# EAGLE schematic m328 (EAGLE 6.5.0)
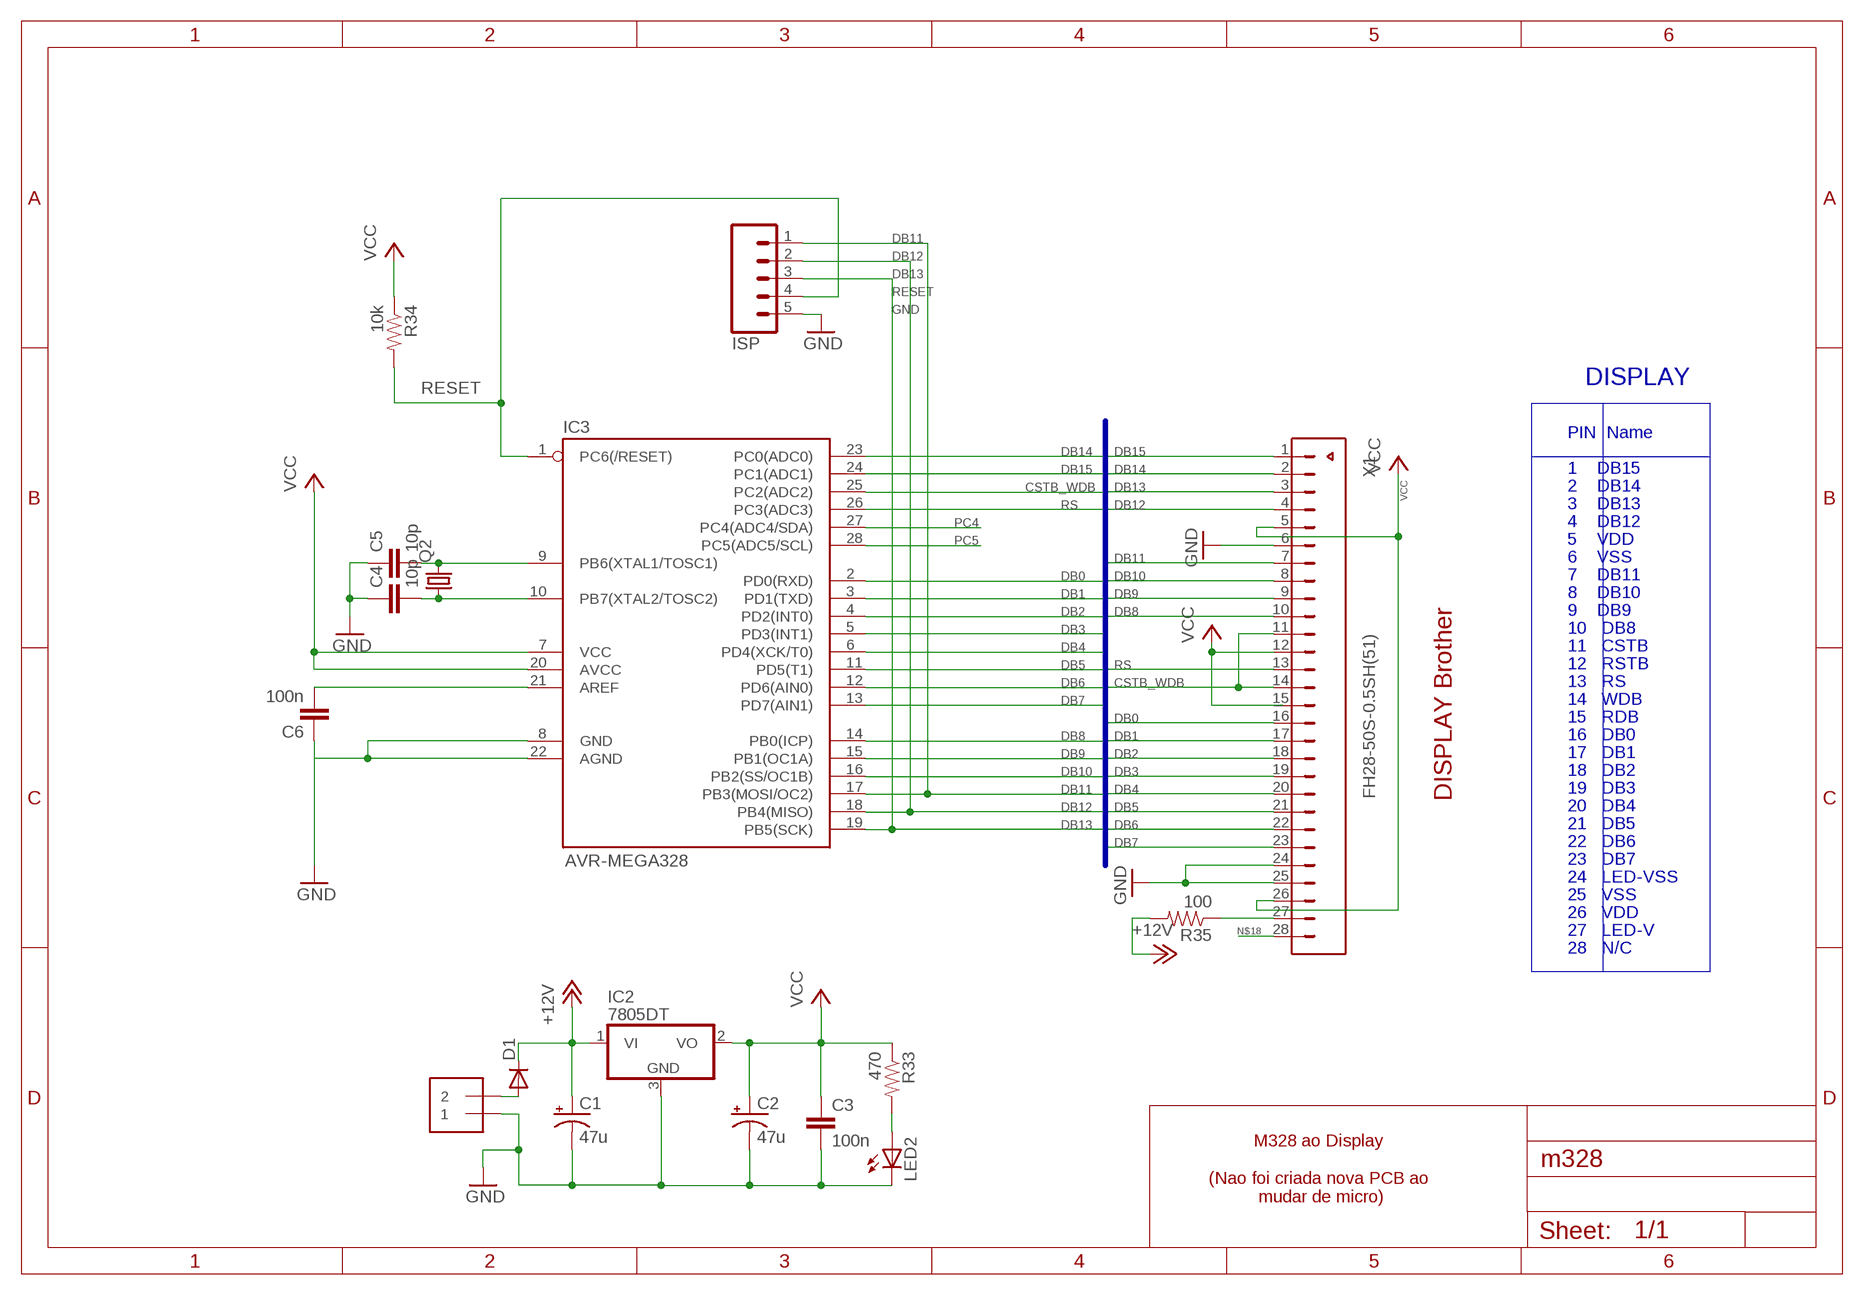
[diagram p0: schematic, sheet 1]

## Parts
C1  47u  CAP_POL1206-KIT  [EIA3216-KIT]
C2  47u  CAP_POL1206-KIT  [EIA3216-KIT]
C3  100n  CAP0805  [0805]
C4  10p  CAP0805  [0805]
C5  10p  CAP0805  [0805]
C6  100n  CAP0805  [0805]
D1  DIODESMA-KIT  [SMA-DIODE-KIT]
IC2  7805DT  [TO252]
IC3  AVR-MEGA328  AVR-MEGA8-PPTH  [DIL28-3]
ISP  M05PTH_LONGPADS  [1X05_LONGPADS]
J2  1X2-3.5MM  [1X2-3.5MM]
LED2  LED3MM  [LED3MM]
Q2  CRYSTALHC49UP  [HC49UP]
R33  470  RESISTOR0805-RES  [0805]
R34  10k  RESISTOR0805-RES  [0805]
R35  100  RESISTOR0805-RES  [0805]
X1  FH28-50S-0.5SH(51)  [FH28-50S-0.5SH(51)]

## Nets
+12V [+12V]: C1.A(+) D1.C IC2.1(VI) R35.2
CSTB_WDB: IC3.25(PC2(ADC2)) X1.11 X1.14
DB0: IC3.2(PD0(RXD)) X1.16
DB1: IC3.3(PD1(TXD)) X1.17
DB2: IC3.4(PD2(INT0)) X1.18
DB3: IC3.5(PD3(INT1)) X1.19
DB4: IC3.6(PD4(XCK/T0)) X1.20
DB5: IC3.11(PD5(T1)) X1.21
DB6: IC3.12(PD6(AIN0)) X1.22
DB7: IC3.13(PD7(AIN1)) X1.23
DB8: IC3.14(PB0(ICP)) X1.10
DB9: IC3.15(PB1(OC1A)) X1.9
DB10: IC3.16(PB2(SS/OC1B)) X1.8
DB11: IC3.17(PB3(MOSI/OC2)) ISP.1 X1.7
DB12: IC3.18(PB4(MISO)) ISP.2 X1.4
DB13: IC3.19(PB5(SCK)) ISP.3 X1.3
DB14: IC3.23(PC0(ADC0)) X1.2
DB15: IC3.24(PC1(ADC1)) X1.1
GND [GND]: C1.C(-) C2.C(-) C3.2 C4.1 C5.1 C6.1 IC2.3(GND) IC3.8(GND) IC3.22(AGND) ISP.5 J2.1 LED2.K(C) X1.6 X1.24 X1.25
N$1: LED2.A R33.2
N$18: X1.28
N$53 [+12V]: D1.A J2.2
N$58 [+12V]: R35.1 X1.27
N$80: C5.2 IC3.9(PB6(XTAL1/TOSC1)) Q2.2
N$81: C6.2 IC3.21(AREF)
N$82: C4.2 IC3.10(PB7(XTAL2/TOSC2)) Q2.1
PC4: IC3.27(PC4(ADC4/SDA))
PC5: IC3.28(PC5(ADC5/SCL))
RESET: IC3.1(PC6(/RESET)) ISP.4 R34.2
RS: IC3.26(PC3(ADC3)) X1.13
VCC [VCC]: C2.A(+) C3.1 IC2.2(VO) IC3.7(VCC) IC3.20(AVCC) R33.1 R34.1 X1.5 X1.12 X1.26
Unconnected: X1.15

## Buses
B$1
DB[1..28]

## Notes on the sheet
- DISPLAY
- PIN  Name
- 1    DB15
- 2    DB14
- 3    DB13
- 4    DB12
- 5    VDD
- 6    VSS
- 7    DB11
- 8    DB10
- DISPLAY Brother
- 9    DB9
- 10   DB8
- 11   CSTB
- 12   RSTB
- 13   RS
- 14   WDB
- 15   RDB
- 16   DB0
- 17   DB1
- 18   DB2
- 19   DB3
- 20   DB4
- 21   DB5
- 22   DB6
- 23   DB7
- 24   LED-VSS
- 25   VSS
- 26   VDD
- 27   LED-V
- 28   N/C
- M328 ao Display
  
  (Nao foi criada nova PCB ao
   mudar de micro)

## Library data of the parts
C1 C2 = SparkFun:CAP_POL: Capacitor Polarized These are standard SMD and PTH capacitors. Normally 10uF, 47uF, and 100uF in electrolytic and tantalum varieties. Always verify the external diameter of the through hole cap, it varies with capacity, voltage, and manufacturer. The EIA devices should be standard.
C3-C6 = SparkFun:CAP: Capacitor Standard 0603 ceramic capacitor, and 0.1" leaded capacitor.
D1 = SparkFun:DIODE: Diode These are standard reverse protection diodes and small signal diodes. SMA package can handle up to about 1A. SOD-323 can handle about 200mA. What the SOD-323 package when ordering, there are some mfgs out there that are 5-pin packages.
IC2 = linear:78*: Positive VOLTAGE REGULATOR Source: http://cache.national.com/ds/LM/LM78L05.pdf http://www.fairchildsemi.com/ds/LM/LM7805.pdf
IC3 = SparkFun:AVR-MEGA8-P: MICROCONTROLLER 8 Kbytes FLASH 1 kbytes SRAM 512 bytes EEPROM USART 4-channel 10 bit ADC 2-channel 8 bit ADC
ISP = SparkFun:M05: Header 5 Standard 5-pin 0.1" header. Use with straight break away headers (SKU : PRT-00116), right angle break away headers (PRT-00553), swiss pins (PRT-00743), machine pins (PRT-00117), and female headers (PRT-00115). Molex polarized connector foot print use with SKU : PRT-08230 with associated crimp pins and housings.
J2 = adafruit:1X2: 3.5mm Terminal block http://www.ladyada.net/library/pcb/eaglelibrary.html
LED2 = SparkFun:LED: LEDs Standard schematic elements and footprints for 5mm, 3mm, 1206, and 0603 sized LEDs. 5mm - Spark Fun Electronics SKU : COM-00529 (and others)
Q2 = crystal:CRYSTAL: CRYSTAL; OC_FARNELL: unknown; OC_NEWARK: unknown
R33-R35 = SparkFun:RESISTOR: Resistor Basic schematic elements and footprints for 0603, 1206, and PTH resistors.
X1 = con-hirose:FH28-50S-0.5SH(51): Flexible Printed Circuit & Flexible Flat Cable ZIF Connectors 0.5 mm Pitch, 2.55 mm above the board Source: http://www.hirose.co.jp/cataloge_hp/e58618038.pdf; OC_FARNELL: unknown; OC_NEWARK: unknown

## Net classes
0 default: width 0.203 mm
1 EN_B: width 0.4 mm
2 EN_A: width 0.4 mm
3 VCC: width 0.4 mm
4 GND: width 0.4 mm
5 +24V: width 1 mm
6 +12V: width 0.4 mm